# Altium schematic sheet Blokkskjema.SchDoc
size A2
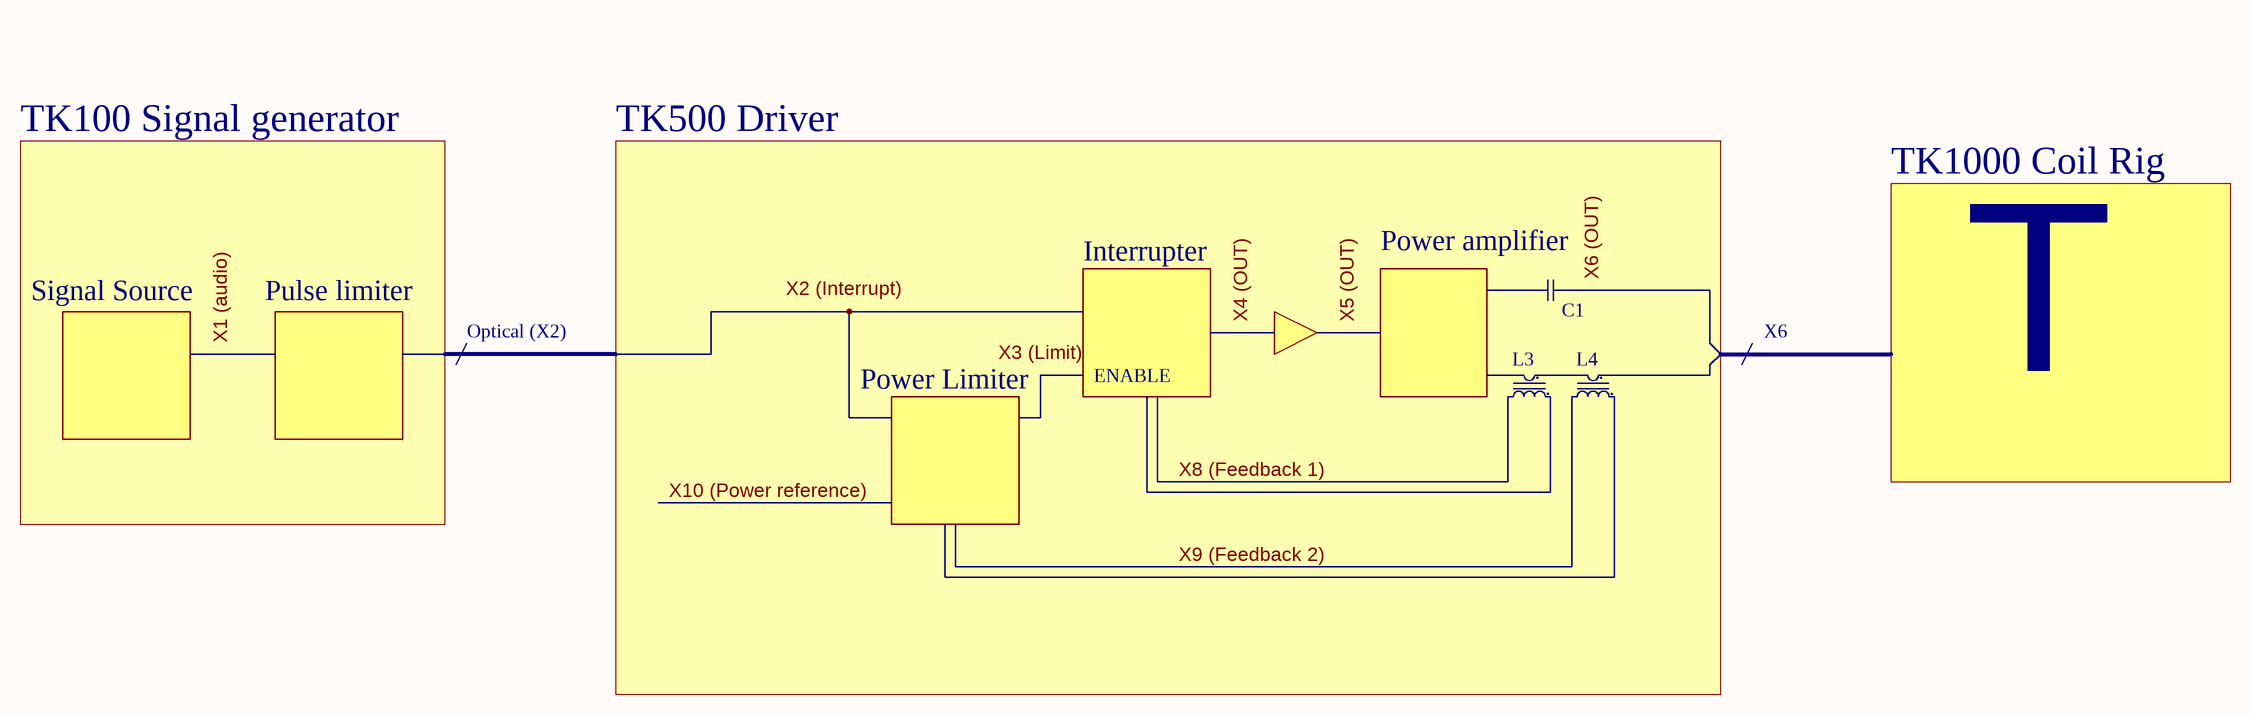
[diagram p0: Blokkskjema.SchDoc]

## Parts
C1  100nF  [CAPC0603(1608)55_N]  (value not drawn)
L3  CurrentSenseTransformer  (value not drawn)
L4  CurrentSenseTransformer  (value not drawn)

## Blocks framed on the sheet
TK500 Driver: C1 L3 L4

## Nets
X8 (Feedback 1): L3.3
X9 (Feedback 2): L4.3
NetC1_1: C1.1 L4.2
NetL3_2: L3.2 L4.1

Not connected (* = marked no-connect by the designer): C1 2; L3 1 4; L4 4

## Notes on the sheet
- TK100 Signal generator
- TK1000 Coil Rig
- Signal Source
- Pulse limiter
- Interrupter
- (near C1) Power amplifier
- T
- Optical (X2)
- ENABLE
- X6
- Power Limiter
- Labels drawn without touching a wire or pin: X1 (audio), X2 (Interrupt), X3 (Limit), X4 (OUT), X5 (OUT), X6 (OUT)
- Title
- Size:
- Date:
- File:
- A2
- Number:
- Time:
- Revision:
- Sheet
- of

## Library data of the parts
C1 = 3028: X7R 50V 5%; id: 3028; pakke_opprettet_av: 815; pakke_opprettet: 18.02.2015 14.18.13; symbol_opprettet: 14.11.2014 20.19.34; leverandor_varenr: 1759122; pris: 1; nokkelord: Kondensator, Capacitor, CAP; produsent: Multikomp; leverandor: Farnell; pakketype: 0603; symbol_opprettet_av: 815; navn: 100nF
L3 L4 = 3771: id: 3771; symbol_opprettet_av: 815; symbol_opprettet: 29.09.2016 16.19.11; pris: 100; produsent: OV; navn: CurrentSenseTransformer; pakketype: -